# Altium schematic sheet 1_EVB_A32QS1_RFRG_Schematic.SchDoc
size A4; Author: Dennis C. M; CompanyName: Dennis Micro Computers; DrawnBy: Dennis C. M.; SheetNumber: 1; SheetTotal: 1; Size: A4
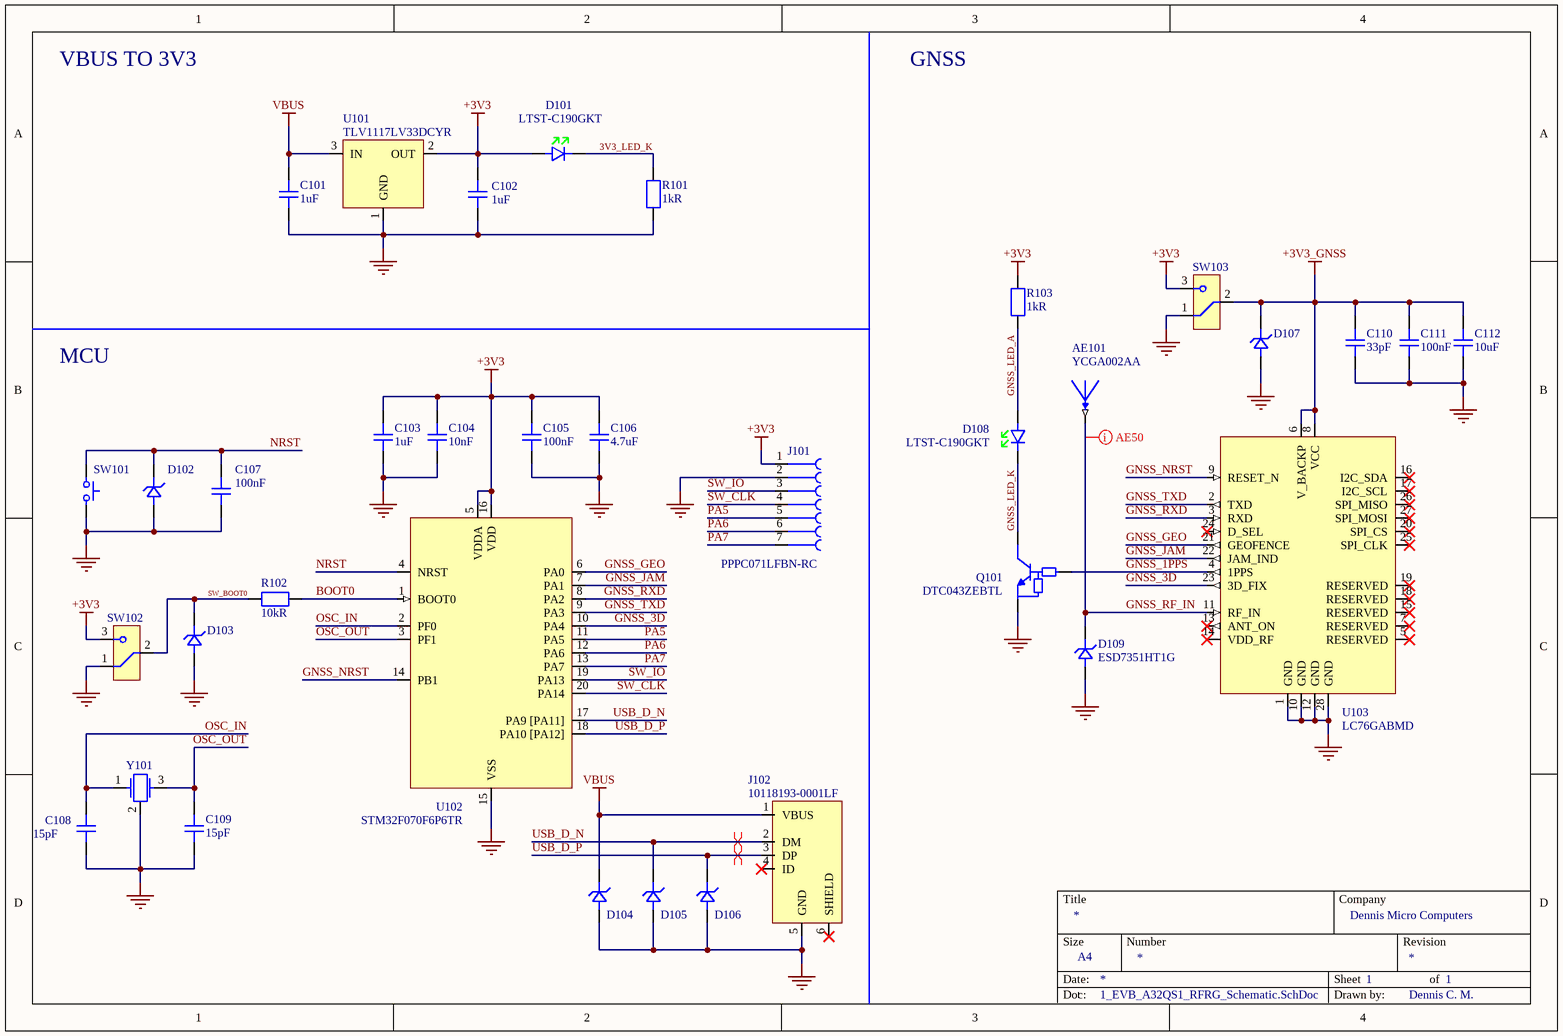
[diagram p0: 1_EVB_A32QS1_RFRG_Schematic.SchDoc]

## Parts
AE101  YCGA002AA  [AE_Quectel_YCGA002AA]
C101  value 1uF  [C_Yageo_CC_0402_A]  (hidden comment: CC0402MRX5R6BB105)
C102  value 1uF  [C_Yageo_CC_0402_A]  (hidden comment: CC0402MRX5R6BB105)
C103  value 1uF  [C_Yageo_CC_0402_A]  (hidden comment: CC0402MRX5R6BB105)
C104  value 10nF  [C_Yageo_CC_0402_A]  (hidden comment: CC0402KRX7R7BB103)
C105  value 100nF  [C_Samsung_CL_0402_A]  (hidden comment: CL05B104KP5NNNC)
C106  value 4.7uF  [C_Samsung_CL_0402_A]  (hidden comment: CL05A475MP5NRNC)
C107  value 100nF  [C_Samsung_CL_0402_A]  (hidden comment: CL05B104KP5NNNC)
C108  value 15pF  [C_Yageo_CC_0402_A]  (hidden comment: CC0402JRNPO9BN150)
C109  value 15pF  [C_Yageo_CC_0402_A]  (hidden comment: CC0402JRNPO9BN150)
C110  value 33pF  [C_Samsung_CL_0402_A]  (hidden comment: CL05C330JB5NNNC)
C111  value 100nF  [C_Samsung_CL_0402_A]  (hidden comment: CL05B104KP5NNNC)
C112  value 10uF  [C_Samsung_CL_0805_A]  (hidden comment: CL21A106KOQNNNE)
D101  LTST-C190GKT  [D_LED_Lite-On_Green_0603_A]
D102  D5V0F1U2S9-7  [D_TVS_Uni_Diodes_SOD-923_B]  (value not drawn)
D103  D5V0F1U2S9-7  [D_TVS_Uni_Diodes_SOD-923_B]  (value not drawn)
D104  D5V0F1U2S9-7  [D_TVS_Uni_Diodes_SOD-923_B]  (value not drawn)
D105  D5V0F1U2S9-7  [D_TVS_Uni_Diodes_SOD-923_B]  (value not drawn)
D106  D5V0F1U2S9-7  [D_TVS_Uni_Diodes_SOD-923_B]  (value not drawn)
D107  D5V0F1U2S9-7  [D_TVS_Uni_Diodes_SOD-923_B]  (value not drawn)
D108  LTST-C190GKT  [D_LED_Lite-On_Green_0603_A]
D109  ESD7351HT1G  [D_TVS_Uni_Onsemi_SOD-323]
J101  PPPC071LFBN-RC  [J_Sullins_01x07_Socket_2.54mm]
J102  10118193-0001LF  [J_USB_Micro-B_Amphenol_10118193-0001LF]
Q101  DTC043ZEBTL  [Q_Rohm_SOT-416FL_B]
R101  value 1kR  [R_Yageo_RCL_0402_A]  (hidden comment: RC0402FR-071KL)
R102  value 10kR  [R_Yageo_RCL_0402_A]  (hidden comment: RC0402FR-0710KL)
R103  value 1kR  [R_Yageo_RCL_0402_A]  (hidden comment: RC0402FR-071KL)
SW101  PTS647SN50SMTR2LFS  [SW_Tactitle_SPST_C&K_PTS647SN50SMTR2LFS]  (value not drawn)
SW102  JS102011JCQN  [SW_Slide_C&K_JS102011JCQN]  (value not drawn)
SW103  JS102011JCQN  [SW_Slide_C&K_JS102011JCQN]  (value not drawn)
U101  TLV1117LV33DCYR  [U_TI_SOT-223_B]
U102  STM32F070F6P6TR  [U_ST_TSSOP20_B]
U103  LC76GABMD  [U_QUECTEL_LC76G]
Y101  ECS-240-12-37B-CKY-TR  [Y_Crystal_GND24_ECS_240-12-37B-CKY-TR]  (value not drawn)

## Nets
+3V3: C102.2 C103.2 C104.2 C105.2 C106.2 D101.2 J101.1 R103.2 SW102.3 SW103.3 U101.2(OUT) U102.5(VDDA) U102.16(VDD)
+3V3_GNSS: C110.2 C111.2 C112.2 D107.1 SW103.2 U103.6(V_BACKP) U103.8(VCC)
GND: C101.1 C102.1 C103.1 C104.1 C105.1 C106.1 C107.1 C108.1 C109.1 C110.1 C111.1 C112.1 D102.2 D103.2 D104.2 D105.2 D106.2 D107.2 D109.2 J101.2 J102.5(GND) Q101.2(EMITTER) R101.1 SW101.2 SW102.1 SW103.1 U101.1(GND) U102.15(VSS) U103.1(GND) U103.10(GND) U103.12(GND) U103.28(GND) Y101.2
VBUS: C101.2 D104.1 J102.1(VBUS) U101.3(IN)
3V3_LED_K: D101.1 R101.2
BOOT0: R102.2 U102.1(BOOT0)
GNSS_1PPS: Q101.1(BASE) U103.4(1PPS)
GNSS_3D: U102.10(PA4) U103.23(3D_FIX)
GNSS_GEO: U102.6(PA0) U103.21(GEOFENCE)
GNSS_JAM: U102.7(PA1) U103.22(JAM_IND)
GNSS_LED_A: D108.2 R103.1
GNSS_LED_K: D108.1 Q101.3(COLLECTOR)
GNSS_NRST: U102.14(PB1) U103.9(RESET_N)
GNSS_RF_IN: AE101.1 D109.1 U103.11(RF_IN)
GNSS_RXD: U102.8(PA2) U103.3(RXD)
GNSS_TXD: U102.9(PA3) U103.2(TXD)
NRST: C107.2 D102.1 SW101.1 U102.4(NRST)
OSC_IN: C108.2 U102.2(PF0) Y101.1
OSC_OUT: C109.2 U102.3(PF1) Y101.3
PA5: J101.5 U102.11(PA5)
PA6: J101.6 U102.12(PA6)
PA7: J101.7 U102.13(PA7)
SW_BOOT0: D103.1 R102.1 SW102.2
SW_CLK: J101.4 U102.20(PA14)
SW_IO: J101.3 U102.19(PA13)
USB_D_N: D105.1 J102.2(DM) U102.17(PA9_[PA11])
USB_D_P: D106.1 J102.3(DP) U102.18(PA10_[PA12])

Not connected (* = marked no-connect by the designer): J102 4(ID)* 6(SHIELD)*; U103 5(RESERVED)* 7(RESERVED)* 13(ANT_ON)* 14(VDD_RF)* 15(RESERVED)* 16(I2C_SDA)* 17(I2C_SCL)* 18(RESERVED)* 19(RESERVED)* 20(SPI_CS)* 24(D_SEL)* 25(SPI_CLK)* 26(SPI_MISO)* 27(SPI_MOSI)*

## Layout directives
differential pair; differential pair class DIFF_USB: USB_D_N, USB_D_P
net class AE50: GNSS_RF_IN

## Notes on the sheet
- VBUS TO 3V3
- GNSS
- MCU
- Title
- Company
- Size
- Date:
- A4
- Number
- Sheet
- Revision
- of
- Doc:
- Drawn by:

## Library data of the parts
AE101 = CMP-00025-00001-2: Antenna Module Linear 1602MHz; Manufacturer: Quectel; Frequency Range: 1.559GHz ~ 1.606GHz; Antenna Type: Ceramic Patch; Frequency (Center/Band): 1.5825GHz; Frequency Group: UHF (1GHz ~ 2GHz); RF Family/Standard: Navigation; Number of Bands: 1; Mounting Type: Surface Mount; Applications: GNSS, GPS
C101-C103 = CMP-001-00016-11: Multilayer Ceramic Capacitor, 1 uF, 50 V, ± 10%, X5R, 0402 [1005 Metric]; Voltage Rating (DC): 10V; Tolerance: 20%; Temperature Coefficient: 30ppm/°C; Material: Ceramic; Case Code (Metric): 1005; Case Code (Imperial): 0402; Case/Package: 0402; Width: 0.02inch; Pins: 2; LCSC Part Number: C113791; Dielectric: X5R; Termination: SMD/SMT; Mounting Technology: Surface Mount; Dissipation Factor: 10%; RoHS Compliant: Yes; Height: 0.5mm; Series: CC; Voltage Rating: 10V; Packaging: Tape and Reel; ComponentLink1URL: https://www.yageo.com/upload/media/product/app/datasheet/mlcc/upy-gphc_x5r_4v-to-50v.pdf; Thickness: 0.022inch; Min Operating Temperature: -55°C; Lead Free: Lead Free; Max Operating Temperature: 85°C; ComponentLink1Description: Datasheet; Halogen Free: Halogen Free; Length: 0.039inch
C104 = CMP-001-00029-1: Multilayer Ceramic Capacitor, 0.01 uF, 16 V, ± 10%, X7R, 0402 [1005 Metric]; Dissipation Factor: 3.5%; Voltage Rating: 16V; Temperature Coefficient: 30ppm/°C; Insulation Resistance: 10GR; Termination: SMD/SMT; Package Quantity: 1; Tolerance: 10%; ComponentLink1URL: https://www.yageo.com/upload/media/product/productsearch/datasheet/mlcc/UPY-GPHC_X7R_6.3V-to-250V_24.pdf; Series: CC; Dielectric: X7R; Min Operating Temperature: -55°C; Length: 1mm; Depth: 0.5mm; Case/Package: 0402; Lead Free: Lead Free; Mounting Technology: Surface Mount; Pins: 2; ComponentLink1Description: Datasheet; Reach SVHC Compliant: No; Voltage Rating (DC): 16V; Thickness: 0.022inch; Width: 0.02inch; Max Operating Temperature: 125°C; Voltage Rating (AC): 16V; Radiation Hardening: No; Case Code (Imperial): 0402; Halogen Free: Halogen Free; Height: 0.5mm; Case Code (Metric): 1005; Packaging: Tape and Reel; RoHS Compliant: Yes; Material: Ceramic
C105 C107 C111 = CMP-001-00023-3: Multilayer Ceramic Capacitor, 0.1 uF, 10 V, ± 10%, X7R, 0402 [1005 Metric]; Voltage Rating (DC): 10V; RoHS Compliant: Yes; Max Operating Temperature: 125°C; Mounting Technology: Surface Mount; Material: Ceramic; Depth: 0.5mm; Thickness: 0.022inch; Packaging: Tape and Reel; Case Code (Imperial): 0402; Height: 0.5mm; Voltage Rating: 10V; Width: 0.02inch; Min Operating Temperature: -55°C; Length: 1mm; Package Quantity: 1; Dielectric: X7R; Radiation Hardening: No; Construction: Flat; Tolerance: 10%; Case/Package: 0402; Case Code (Metric): 1005; Series: CL
C106 = CMP-001-00024-3: Multilayer Ceramic Capacitor, 4.7 uF, 10 V, ± 20%, X5R, 0402 [1005 Metric]; Voltage Rating: 10V; Case Code (Metric): 1005; Tolerance: 20%; ComponentLink1Description: Datasheet; Max Operating Temperature: 85°C; Material: Ceramic; Case Code (Imperial): 0402; Lead Free: Lead Free; Height: 550um; RoHS Compliant: Yes; Mounting Technology: Surface Mount; Series: CL; Packaging: Cut Tape; Dielectric: X5R; Case/Package: 0402; ComponentLink1URL: https://mm.digikey.com/Volume0/opasdata/d220001/medias/docus/863/CL05A475MP5NRNC_Spec.pdf; Min Operating Temperature: -55°C
C108 C109 = CMP-001-00017-14: Multilayer Ceramic Capacitor, 15 pF, 10 V, ± 5%, X7R, 0402 [1005 Metric]; Temperature Coefficient: 30ppm/°C; Voltage Rating (DC): 50V; Dielectric: C0G; Insulation Resistance: 100GR; RoHS Compliant: Yes; Tolerance: 5%; Radiation Hardening: No; Lead Free: Lead Free; Pins: 2; Case Code (Metric): 1005; Mounting Technology: Surface Mount; Termination: SMD/SMT; Packaging: Tape and Reel; Material: Ceramic; Voltage Rating: 50V; Height: 0.5mm; Package Quantity: 1; Thickness: 0.022inch; ComponentLink1URL: https://www.yageo.com/upload/media/product/productsearch/datasheet/mlcc/UPY-GP_NP0_16V-to-50V_18.pdf; Dielectric Material: Ceramic; Voltage Rating (AC): 50V; Case/Package: 0402; Halogen Free: Halogen Free; Depth: 0.5mm; ComponentLink1Description: Datasheet; Length: 1mm; Case Code (Imperial): 0402; Width: 0.02inch; Min Operating Temperature: -55°C; Reach SVHC Compliant: No; Voltage: 50V; Series: CC; Max Operating Temperature: 125°C
C110 = CMP-001-00030-2: Multilayer Ceramic Capacitor, 33 pF, 50 V, ± 5%, C0G (NP0), 0402 [1005 Metric]; Voltage: 50V; Temperature Coefficient: 300ppm/°C; Material: Ceramic; Min Operating Temperature: -55°C; ComponentLink1Description: Datasheet; Width: 0.02inch; Thickness: 0.022inch; ComponentLink1URL: https://mm.digikey.com/Volume0/opasdata/d220001/medias/docus/2969/CL05C330JB5NNNC_Spec.pdf; Construction: Flat; Series: CL; Lead Free: Lead Free; Voltage Rating: 50V; Voltage Rating (DC): 50V; RoHS Compliant: Yes; Packaging: Tape and Reel; Package Quantity: 1; Tolerance: 5%; Case/Package: 0402; Height: 0.5mm; Case Code (Metric): 1005; Length: 1mm; Case Code (Imperial): 0402; Dielectric: C0G; Depth: 0.5mm; Mounting Technology: Surface Mount; Max Operating Temperature: 125°C; Radiation Hardening: No
C112 = CMP-001-00022-4: Multilayer Ceramic Capacitor, 10 uF, 16 V, ± 10%, X5R, 0805 [2012 Metric]; Dielectric: X7R; Voltage: 16V; Case Code (Imperial): 0805; Case Code (Metric): 2012; Material: Ceramic; Width: 0.049inch; Thickness: 0.055inch; Tolerance: 10%; Series: CL; Max Operating Temperature: 85°C; ComponentLink1URL: https://mm.digikey.com/Volume0/opasdata/d220001/medias/docus/609/CL21A106KOQNNNE_Spec.pdf; Case/Package: 0805; RoHS Compliant: Yes; Depth: 1.25mm; Packaging: Tape and Reel; Min Operating Temperature: -55°C; ComponentLink1Description: Datasheet; Radiation Hardening: No; Mounting Technology: Surface Mount; Voltage Rating: 16V; Voltage Rating (DC): 16V; Package Quantity: 1; Height: 1.25mm; Length: 2mm; Lead Free: Lead Free; Construction: Flat
D101 D108 = CMP-007-00001-3: LED Uni-Color Green 565nm 2-Pin Chip LED T/R; Dominant Wavelength: 569nm; Forward Current: 30mA; Reverse Voltage: 5V; Lens Transparency: Clear; Power Dissipation: 100mW; Number of Elements: 1; Viewing Angle: 130°; Test Current: 10mA; Forward Voltage: 2.1V; Lens Color: Colorless; Voltage: 2V; Lens Size: 0.8mm; Lens Style: Flat,Diffused,Colorless,Rectangular,Clear; Luminous Intensity: 6mcd; ComponentLink1URL: https://mm.digikey.com/Volume0/opasdata/d220001/medias/docus/858/LTST-C190GKT.pdf; Width: 0.8mm; Lead Free: Lead Free; Height: 0.9mm; Max Operating Temperature: 85°C; Pins: 2; Wavelength: 565nm; Radiation Hardening: No; Series: -; Mounting Technology: Surface Mount; Min Operating Temperature: -55°C; Depth: 0.8mm; Power Rating: 100mW; Length: 1.6mm; ComponentLink1Description: Datasheet; Packaging: Tape and Reel; Case Code (Imperial): 0603; Case/Package: 0603; Illumination Color: Green; Color: Green; Number of LEDs: 1; Case Code (Metric): 1608; Package Quantity: 1; RoHS Compliant: Yes
D102-D107 = CMP-004-00007-2: Diode TVS Dual Uni-Dir 5.5V 250000W 2-Pin SOD-923 T/R; Max Reverse Leakage Current: 100nA; Number of Unidirectional Channels: 1; ESD Protection: Yes; Diode Type: ZENER; Max Surge Current: 1.5A; Min Breakdown Voltage: 6V; Polarity: Unidirectional; Value: 5E-13F; Max Power Dissipation: 250mW; Clamping Voltage: 10V; Peak Pulse Power: 250kW; Contact Plating: Tin,Matte; Termination: SMD/SMT; Reverse Standoff Voltage: 5.5V; ComponentLink1URL: https://www.diodes.com/assets/Datasheets/D5V0F1U2S9.pdf; Min Operating Temperature: -65°C; RoHS Compliant: Yes; Peak Pulse Current: 1.5A; Series: -; ComponentLink1Description: Datasheet; Case/Package: SOD-923-2; Power Line Protection: Yes; Max Operating Temperature: 150°C; Mounting Technology: Surface Mount; Package Quantity: 10000; Packaging: Tape and Reel; Direction: Unidirectional; Breakdown Voltage: 6V; Working Voltage: 5.5V
D109 = CMP-004-00006-1: TVSDIODE3.3VWMSOD-323; Diode Type: ZENER; Min Breakdown Voltage: 5V; Power Line Protection: No; Number of Unidirectional Channels: 1; Reverse Standoff Voltage: 3.3V; Max Operating Temperature: 150°C; Packaging: Tape and Reel; Lead Free: Lead Free; Series: Automotive, AEC-Q101; ComponentLink1URL: https://www.onsemi.com/pdf/datasheet/esd7351-d.pdf; Min Operating Temperature: -55°C; Case/Package: SOD; Package Quantity: 3000; RoHS Compliant: Yes; Mounting Technology: Surface Mount; ComponentLink1Description: Datasheet
J101 = CMP-002-00007-1: Conn Hdr 7POS 0.1 Gold Pcb; Connector Type: Header; Voltage Rating: 250V; Number of Positions: 7; Packaging: Tray; Flammability Rating: UL94 V-0; Mounting Technology: Through Hole; ComponentLink1Description: Datasheet; RoHS Compliant: Yes; Fastening Type: Pull; Contact Shape: Square; Lead Free: Lead Free; Housing Material: Plastic; Height: 8.5mm; Length: 18.3mm; Insulation Color: Black; Series: -; Insulation Material: Polyester; Number of Rows: 1; Termination: Solder; ComponentLink1URL: https://mm.digikey.com/Volume0/opasdata/d220001/medias/docus/937/Female_Headers.100_DS.pdf; Width: 2.5mm; Contact Type: Female Socket; Contact Finish - Mating: GOLD; Min Operating Temperature: -40°C; Contact Material: Bronze; Max Operating Temperature: 105°C
J102 = CMP-002-00002-12: Usb Connector, 5 Contact(S), Female, Right Angle, Surface Mount Terminal, Locking, Receptacle; Max Voltage Rating (AC): 100V; USB Standard: USB 2.0; Connector Type: USB,Receptacle; Number of Contacts: 5; Number of Ports: 1; Insulation Resistance: 1GR; Pitch: 650um; Current Rating: 1.8A; Flammability Rating: UL94 V-0; Termination: Solder; Height: 3mm; Pins: 11; Min Operating Temperature: -55°C; Contact Plating: Gold; Depth: 5.67mm; ComponentLink2Description: Datasheet; Voltage Rating: 100V; Contact Material: Nickel,Gold; Packaging: Tape and Reel; Orientation: Right Angle; Series: -; Mounting Technology: Surface Mount,Horizontal; Housing Material: Polymer; Color: Black; ComponentLink1URL: https://cdn.amphenol-cs.com/media/wysiwyg/files/drawing/10118193.pdf; ComponentLink1Description: Drawing; Gender: Female; Package Quantity: 1200; Radiation Hardening: No; Max Operating Temperature: 85°C; Length: 7.86mm; Features: Shielded; ComponentLink2URL: https://cdn.amphenol-cs.com/media/wysiwyg/files/documentation/datasheet/inputoutput/io_usb_micro.pdf
Q101 = CMP-013-00001-2: TRANS PREBIAS NPN 50V EMT3F; Transition Frequency: 250MHz; Collector-emitter Voltage-Max: 150mV; Continuous Collector Current: 100mA; Output Voltage: 50mV; Max Power Dissipation: 150mW; Series: -; Max Breakdown Voltage: 50V; Package Quantity: 3000; Polarity: NPN; Lead Free: Lead Free; Mounting Technology: Surface Mount; Max Operating Temperature: 150°C; Collector Emitter Breakdown Voltage: 50V; ComponentLink1URL: https://fscdn.rohm.com/en/products/databook/datasheet/discrete/transistor/digital/dtc043zebtl-e.pdf; Clock Frequency: 250MHz; RoHS Compliant: Yes; Min Operating Temperature: -55°C; Pins: 3; Packaging: Tape and Reel; Max Collector Current: 100mA; Radiation Hardening: No; ComponentLink1Description: Datasheet
R101 R103 = CMP-009-00002-11: SMD Chip Resistor, 1 kOhm, ± 1%, 62.5 mW, 0402 [1005 Metric], Thick Film, General Purpose; Max Power Dissipation: 63mW; Temperature Coefficient: 100ppm/°C; Voltage Rating (AC): 50V; Power Rating: 62.5mW; Lead Free: Lead Free; Min Operating Temperature: -55°C; Depth: 0.5mm; Pins: 2; Packaging: Tape and Reel; Height: 0.32mm; Width: 0.5mm; Series: RC; Case Code (Metric): 1005; Resistor Type: Thick Film; Reach SVHC Compliant: No; Military Standard: Not; Case Code (Imperial): 0402; ComponentLink1Description: Datasheet; Features: Moisture Resistant; Voltage Rating: 50V; Case/Package: 0402; Resistance Tolerance: 1%; Termination: SMD/SMT; Number of Terminations: 2; RoHS Compliant: Yes; Voltage Rating (DC): 50V; Construction: Rectangular; Technology: THICK FILM; Tolerance: 1%; Max Operating Temperature: 155°C; Length: 1mm; ComponentLink1URL: https://www.yageo.com/upload/media/product/products/datasheet/rchip/PYu-RC_Group_51_RoHS_L_12.pdf
R102 = CMP-009-00003-11: SMD Chip Resistor, 10 kOhm, ± 1%, 62.5 mW, 0402 [1005 Metric], Thick Film, General Purpose; Voltage Rating (DC): 50V; Temperature Coefficient: 100ppm/°C; Power Rating: 62.5mW; Max Power Dissipation: 63mW; Pins: 2; Lead Pitch: 0.2mm; Resistance Tolerance: 1%; Case Code (Imperial): 0402; Voltage Rating: 50V; Min Operating Temperature: -55°C; Features: Moisture Resistant; Length: 1mm; Series: RC; Width: 0.5mm; Resistor Type: Thick Film; Case Code (Metric): 1005; ComponentLink1URL: https://www.yageo.com/upload/media/product/products/datasheet/rchip/PYu-RC_Group_51_RoHS_L_12.pdf; Tolerance: 1%; Lead Free: Lead Free; Case/Package: 0402; Packaging: Tape and Reel; Reach SVHC Compliant: Unknown; RoHS Compliant: Yes; Number of Terminations: 2; Military Standard: Not; Termination: SMD/SMT; Max Operating Temperature: 155°C; Construction: Rectangular; ComponentLink1Description: Datasheet; Depth: 0.5mm
SW101 = CMP-011-00000-13: Switch Tactile N.O. SPST Round Button Gull Wing 0.05A 12VDC 100000Cycles 0.98N SMD T/R; pin to pad: 1>1+2 2>3+4; Number of Positions: 2; Operating Force: 100gf; Actuator Type: Standard; Illumination Type: Non-Illuminated; Switch Function: Off-Mom; Switch Travel: 0.25mm; Ratings: IP40; Termination: Gull Wing; Packaging: Cut Tape; Mechanical Life: 100000Cycles; ComponentLink1Description: Datasheet; Min Operating Temperature: -20°C; Mounting Technology: Surface Mount; ComponentLink1URL: https://www.ckswitches.com/media/2567/pts647.pdf; Series: PTS647; Throw Configuration: SPST; Max Operating Temperature: 70°C
SW102 SW103 = CMP-011-00001-10: JS Series Sub-Miniature Slide Switch SPDT On-On Top Slide 0.3A 6VDC J-Lead Surface Mount T/R; Actuator Type: Standard; Switch Travel: 2mm; Actuator Material: Nylon,Polyamide,PA46; Voltage Rating (DC): 6V; Electrical Life: 5000Cycles; Min Operating Temperature: -40°C; Contact Material: Copper Alloy; Switch Function: On-On; Mounting Technology: Surface Mount; Series: JS; ComponentLink1URL: https://www.ckswitches.com/media/1422/js.pdf; Max Operating Temperature: 85°C; Actuator Length: 2mm; Contact Plating: Silver; Throw Configuration: SPDT; ComponentLink1Description: Datasheet; Packaging: Cut Tape
U101 = CMP-019-00002-2: LDO Regulator Pos 3.3V 1A 4-Pin(3+Tab) SOT-223 T/R; pin to pad: 2>2+4; Output Type: Fixed; Power Supply Rejection Ratio (PSRR): 75dB; Polarity: Positive; Dropout Voltage: 570mV; Quiescent Current: 50uA; Max Supply Voltage: 5.5V; Accuracy: 2%; Number of Regulators: 1; Min Input Voltage: 2V; ComponentLink1URL: https://www.ti.com/lit/ds/symlink/tlv1117lv.pdf?HQS=dis-dk-null-digikeymode-dsf-pf-null-wwe&ts=1720283554424&ref_url=https%253A%252F%252Fwww.ti.com%252Fgeneral%252Fdocs%252Fsuppproductinfo.tsp%253FdistId%253D10%2526gotoUrl%253Dhttps%253A%252F%252Fwww.ti.com%252Flit%252Fgpn%252Ftlv1117lv; Output Current: 1A; Min Output Voltage: 3.3V; Max Output Voltage: 3.3V; Max Operating Temperature: 125°C; Pins: 4; RoHS Compliant: Yes; Min Operating Temperature: -40°C; Case/Package: SOT-223-4; Packaging: Cut Tape; ComponentLink1Description: Datasheet; Output Configuration: Positive; Series: -; Package Quantity: 2500; Lead Free: Lead Free; Max Output current: 1A; Weight: 0.009171oz; Operating Supply Current: 50uA
U102 = CMP-020-00001-5: IC MCU 32BIT 32KB FLASH 20TSSOP; Core Architecture: ARM; Oscillator Type: Internal; Number of I/Os: 15; Peripherals: POR,PWM,WDT,DMA; Interface: I2C,SPI,USB,UART,USART; ComponentLink1URL: https://www.st.com/content/ccc/resource/technical/document/datasheet/31/4f/10/5f/a5/32/46/42/DM00141386.pdf/files/DM00141386.pdf/jcr:content/translations/en.DM00141386.pdf; Pins: 20; ComponentLink1Description: Datasheet; Case/Package: TSSOP; Memory Format: FLASH; Packaging: Cut Tape; Series: STM32F0; Mounting Technology: Surface Mount; Memory Size: 32KB; Min Operating Temperature: -40°C; Max Operating Temperature: 85°C
U103 = CMP-00025-00000-4: Navigation BeiDou, Galileo, GLONASS, GPS, GNSS Transceiver Module 1.561GHz, 1.575GHz, 1.602GHz Antenna Not Included Surface Mount; Serial Interfaces: I2C, UART; Sensivity: -166dBm; Supply Voltage: 2.55V ~ 3.6V; Mounting Type: Surface Mount; Protocol: BeiDou, Galileo, GLONASS, GPS, GNSS; Package: 28-SMD Module; Frequency: 1.561GHz, 1.575GHz, 1.602GHz
Y101 = CMP-003-00000-11: Crystal 24MHz ±10ppm (Tol) ±10ppm (Stability) 12pF FUND 50Ohm 4-Pin Mini-CSMD T/R; pin to pad: 2>2+4; Frequency: 24MHz; Size: 0.079" L x 0.063" W (2.00mm x 1.60mm); Case/Package: 4-SMD, No Lead; Load Capacitance: 12pF; ComponentLink1Description: Datasheet; ComponentLink1URL: https://ecsxtal.com/store/pdf/ECX-1637B.pdf